# EAGLE design fonte-de-tensao (EAGLE 9.6.2)
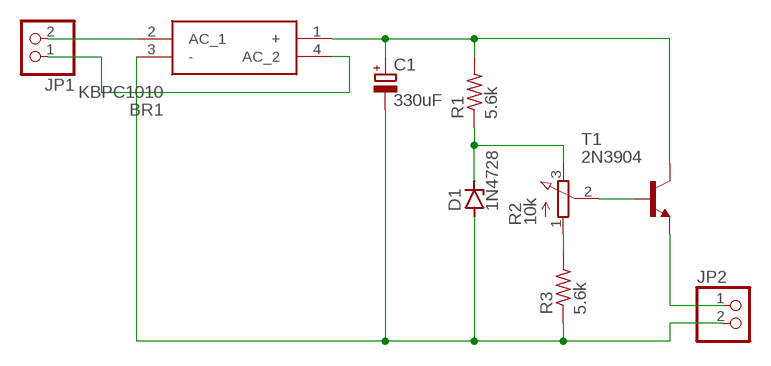
[diagram p0: schematic, sheet 1]

## Parts
BR1  KBPC1010  [KBPC1010]
C1  330uF  CPOL-EUE3.5-10  [E3,5-10]
D1  1N4728  [DO41Z10]
JP1  PINHD-1X2  [1X02]
JP2  PINHD-1X2  [1X02]
R1  5.6k  R-US_0309/12  [0309/12]
R2  10k  3RP/1610N  [3RP/1610N]
R3  5.6k  R-US_0309/12  [0309/12]
T1  2N3904  [TO92]

## Nets
N$1: BR1.4(AC_2) JP1.1
N$2: BR1.2(AC_1) JP1.2
N$3: BR1.1(+) C1.+ R1.2 T1.1(C)
N$4: D1.C R1.1 R2.3(E)
N$5: R2.1(A) R3.2
N$6: BR1.3(-) C1.- D1.A JP2.2 R3.1
N$7: R2.2(S) T1.2(B)
N$8: JP2.1 T1.3(E)

## Library data of the parts
BR1 = KBPC1010:KBPC1010: Bridge Rectifiers KBPC-6 Source: Datasheet <https://datasheet.lcsc.com/szlcsc/1903051202_MDD-Jiangsu-Yutai-Elec-KBPC1010_C3082.pdf>; ARROW_PART_NUMBER: KBPC1010; DESCRIPTION: Bridge Rectifiers KBPC-6; HEIGHT: 5.4mm; MANUFACTURER_NAME: MDD&pound;&uml;Microdiode Electronics&pound;&copy;; MANUFACTURER_PART_NUMBER: KBPC1010
C1 = rcl:CPOL-EU: POLARIZED CAPACITOR, European symbol; SPICEPREFIX: C
D1 = diode:1N4728: Z DIODE 3.3 V, 1W, 5 percent
JP1 JP2 = pinhead:PINHD-1X2: PIN HEADER
R1 R3 = rcl:R-US_: RESISTOR, American symbol; SPICEPREFIX: R
R2 = pot:3RP/1610N: 16mm Potentiometer one level Source: http://www.alphapotentiometers.net/html/16mm_pot_2.html
T1 = transistor:2N3904: NPN TRANSISTOR

## Board
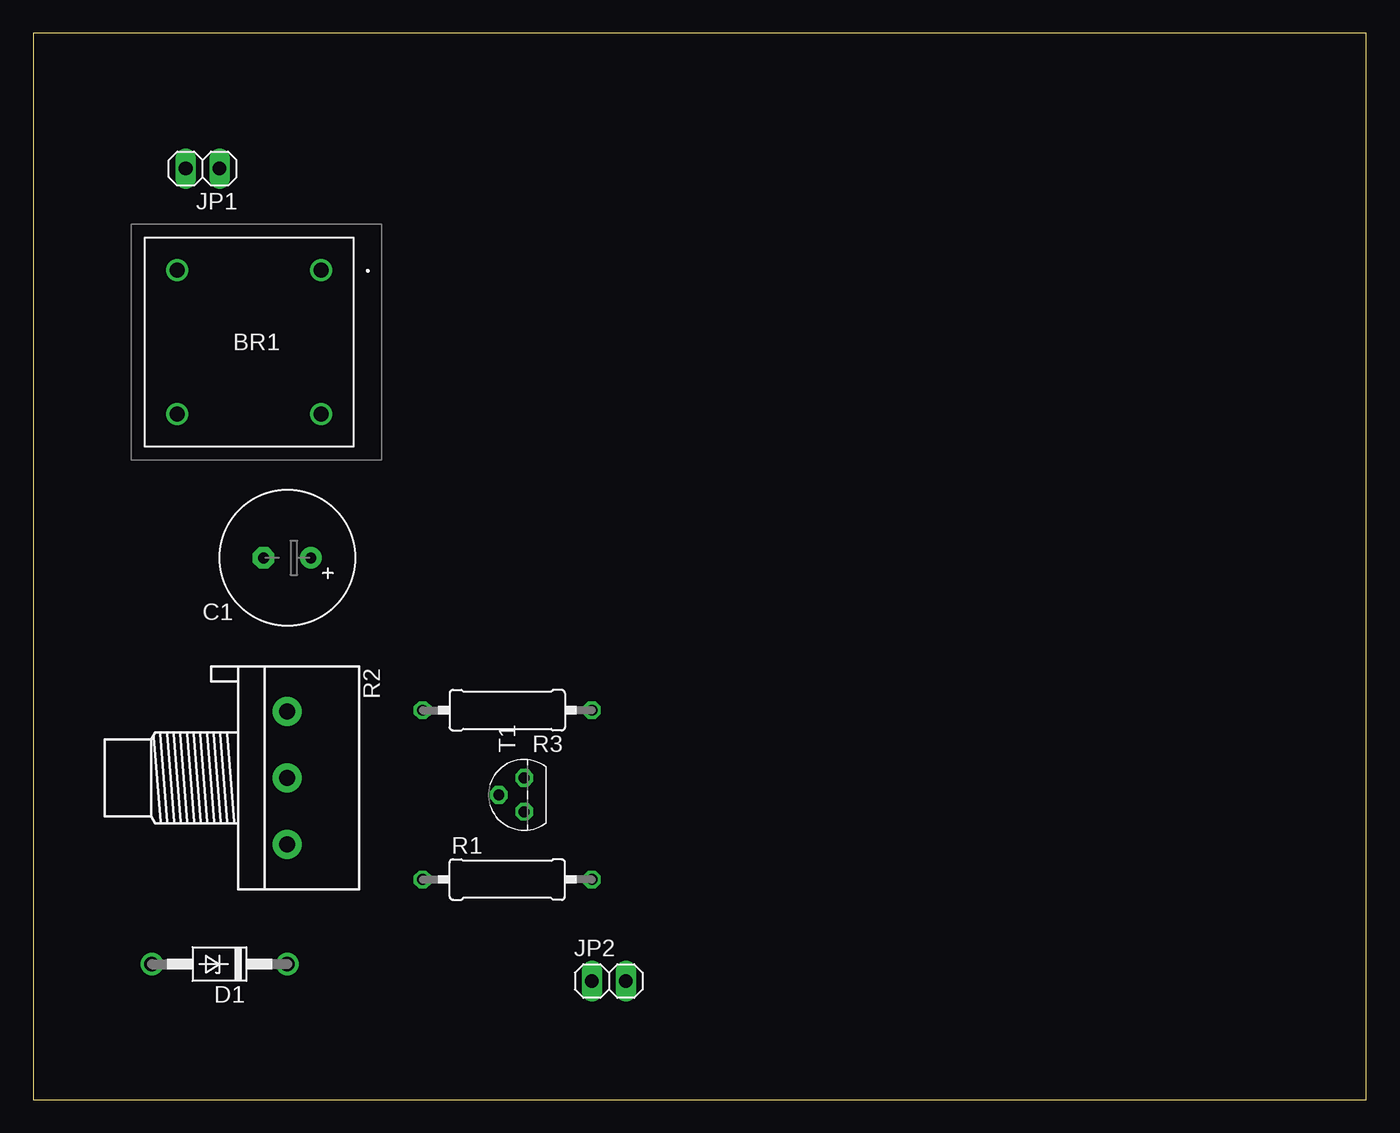
[diagram p1: board, top side]
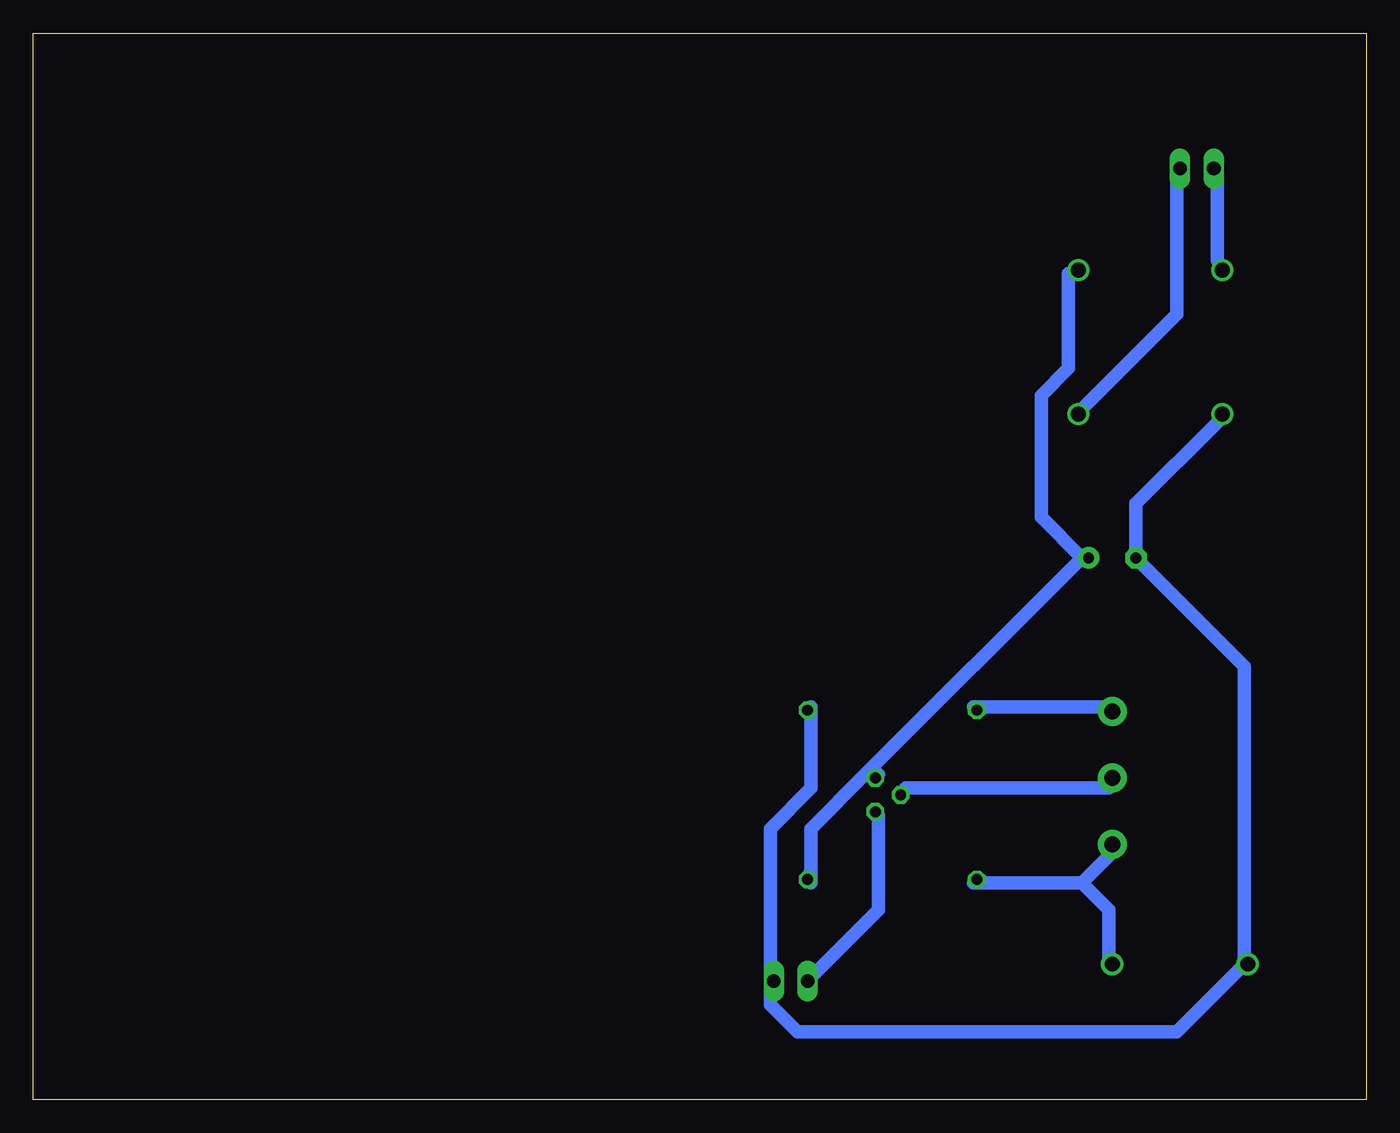
[diagram p2: board, bottom side, seen from below]

Size 100 x 80 mm. Coordinates in mm from the lower left corner, seen from the top.
Outline: 0,0 100,0 100,80 0,80 0,0
Copper layers (1*16): Top 0.035mm / dielectric 1.5mm / Bottom 0.035mm
Design rules "default *": minimum track width 40mil, minimum drill 0.35mm, track to track 40mil, track to pad 40mil, pad to pad 40mil, via to via 40mil, smd to smd 6mil, copper to edge 40mil, drill to drill 6mil, minimum pad ring 10mil, minimum via ring 8mil, stop-mask expansion 4mil, vias tented up to drill 0mil, thermal gap 10mil

### Footprints (pad centres in the part's own frame; a part is rotated, then mirrored left to right if it is on the bottom)
KBPC1010 = drill 1.1 pad 1.65: 1 0,0; 2 10.8,0; 3 10.8,10.8; 4 0,10.8
E3,5-10 = drill 0.813 pad 1.6: + -1.778,0 | drill 0.813 pad 1.6 octagon: - 1.778,0
DO41Z10 = drill 1.118: A 5.08,0; C -5.08,0
1X02 = drill 1.016 long: 1 -1.27,0; 2 1.27,0
0309/12 = drill 0.813 octagon: 1 -6.35,0; 2 6.35,0
3RP/1610N = drill 1.2 pad 2.184: 1 -5,0; 2 0,0; 3 5,0
TO92 = drill 0.813 octagon: 1 1.27,0; 2 0,1.905; 3 -1.27,0

### Placement (x,y rotation side)
BR1  21.59,62.23 180 top
C1  19.05,40.64 180 top
D1  13.97,10.16 180 top
JP1  12.7,69.85 180 top
JP2  43.18,8.89 0 top
R1  35.56,16.51 0 top
R2  19.05,24.13 270 top
R3  35.56,29.21 180 top
T1  36.83,22.86 90 top

### Tracks (layer width: path | path; a pad name or v marks a point on that pad's centre or on a via)
N$1
  Bottom 1.016: JP1.1 14.22,69.09 14.22,58.93 21.34,51.82 BR1.4
N$2
  Bottom 1.016: JP1.2 11.18,69.09 11.18,62.99 BR1.2
N$3
  Bottom 1.016: 37.59,24.38 36.58,24.38 T1.1 | 37.59,24.38 41.66,20.32 41.66,16.26 R1.2 | 37.59,24.38 21.34,40.64 | 21.34,40.64 24.38,43.69 24.38,52.83 22.35,54.86 22.35,61.98 BR1.1 | 21.34,40.64 C1.+
N$4
  Bottom 1.016: 21.34,16.26 29.46,16.26 R1.1 | 21.34,16.26 19.3,18.29 R2.3 | 21.34,16.26 19.3,14.22 19.3,10.16 D1.C
N$5
  Bottom 1.016: R3.2 29.46,29.46 19.3,29.46 R2.1
N$6
  Bottom 1.016: R3.1 41.66,29.46 41.66,23.37 44.7,20.32 44.7,9.14 JP2.2 44.7,8.13 44.7,7.11 42.67,5.08 14.22,5.08 9.14,10.16 | BR1.3 11.18,50.8 17.27,44.7 C1.- 9.14,32.51 9.14,10.16 | 9.14,10.16 D1.A
N$7
  Bottom 1.016: T1.2 34.54,23.37 19.3,23.37 R2.2
N$8
  Bottom 1.016: JP2.1 36.58,14.22 36.58,21.34 T1.3